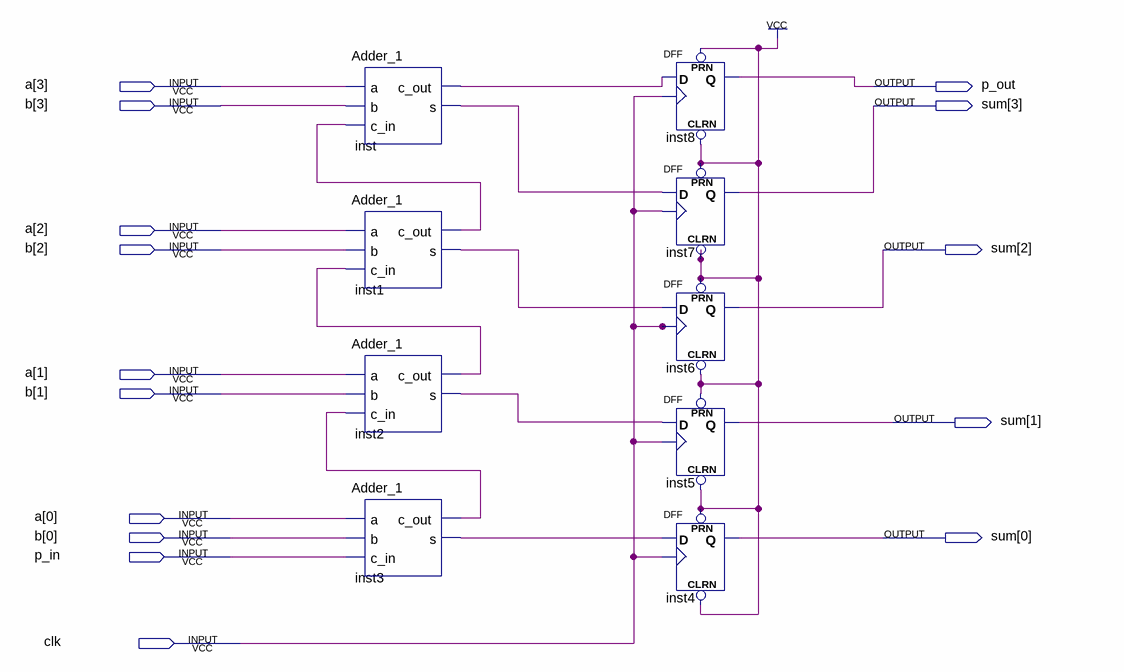
[diagram p0: schematic sheet]
// Quartus schematic Adder_1_c.bdf as structural Verilog: 9 symbols, 15 pins
module Adder_1_c (
  input  [3:0] a,
  input  [3:0] b,
  input  p_in,
  input  clk,
  output p_out,
  output [3:0] sum
);

  wire inst1_c_out, inst1_s, inst2_c_out, inst2_s, inst3_c_out, inst3_s, inst_c_out, inst_s;

  Adder_1 inst (.a(a[3]), .b(b[3]), .c_in(inst1_c_out), .c_out(inst_c_out), .s(inst_s));
  Adder_1 inst1 (.a(a[2]), .b(b[2]), .c_in(inst2_c_out), .c_out(inst1_c_out), .s(inst1_s));
  Adder_1 inst2 (.a(a[1]), .b(b[1]), .c_in(inst3_c_out), .c_out(inst2_c_out), .s(inst2_s));
  Adder_1 inst3 (.a(a[0]), .b(b[0]), .c_in(p_in), .c_out(inst3_c_out), .s(inst3_s));
  DFF inst8 (.CLRN(1'b1), .CLK(clk), .D(inst_c_out), .PRN(1'b1), .Q(p_out));
  DFF inst7 (.CLRN(1'b1), .CLK(clk), .D(inst_s), .PRN(1'b1), .Q(sum[3]));
  DFF inst6 (.CLRN(1'b1), .CLK(clk), .D(inst1_s), .PRN(1'b1), .Q(sum[2]));
  DFF inst5 (.CLRN(1'b1), .CLK(clk), .D(inst2_s), .PRN(1'b1), .Q(sum[1]));
  DFF inst4 (.CLRN(1'b1), .CLK(clk), .D(inst3_s), .PRN(1'b1), .Q(sum[0]));
endmodule
